# EAGLE schematic syacan (EAGLE 9.6.2)
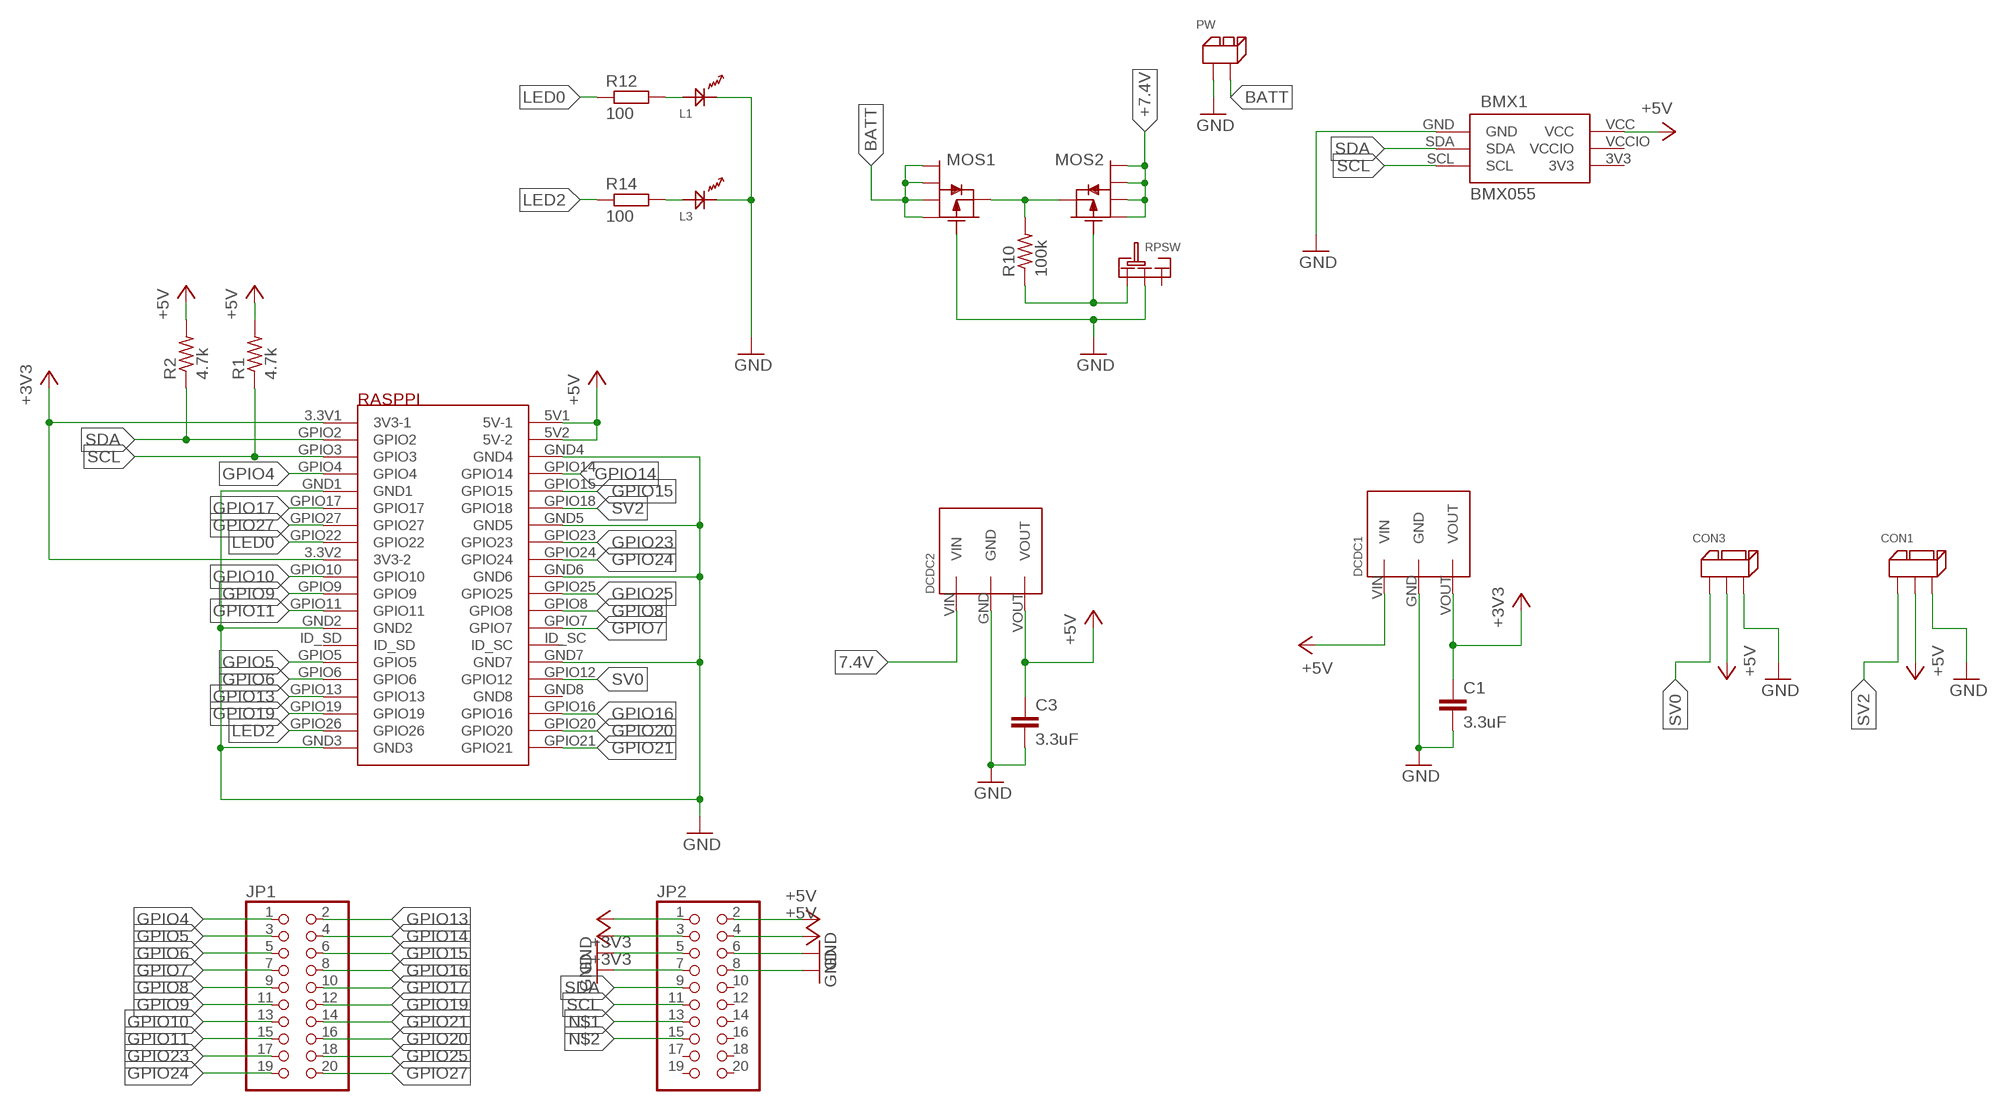
[diagram p0: schematic, sheet 1]

## Parts
BMX1  BMX055  [BMX055]
C1  3.3uF  C-EU025-024X044  [C025-024X044]
C3  3.3uF  C-EU025-024X044  [C025-024X044]
CON1  3PIN  [3PIN]
CON3  3PIN  [3PIN]
DCDC1  3.3V1A_M78AR033-1  [3.3V1A_M78AR033-1]
DCDC2  3.3V1A_M78AR033-1  [3.3V1A_M78AR033-1]
JP1  PINHD-2X10  [2X10]
JP2  PINHD-2X10  [2X10]
L1  OSXX1608C1A  [OSXX1608C1A]
L3  OSXX1608C1A  [OSXX1608C1A]
MOS1  PCH_SSM6J808R  [SSM6J808R]
MOS2  PCH_SSM6J808R  [SSM6J808R]
PW  2PIN  [2PIN]
R1  4.7k  R-US_0204/7  [0204/7]
R2  4.7k  R-US_0204/7  [0204/7]
R10  100k  R-US_R0603  [R0603]
R12  100  R-EU_R0603  [R0603]
R14  100  R-EU_R0603  [R0603]
RASPPI  RASPBERYPIZEROW  [RASPBERYPIZEROW]
RPSW  SRIDE_SWITCH  [SRIDE_SWITCH]

## Nets
7.4V: DCDC2.VIN
+3V3: C1.1 DCDC1.VOUT JP2.1 RASPPI.3.3V1(3V3-1) RASPPI.3.3V2(3V3-2)
+5V: BMX1.VCC C3.1 CON1.P$2 CON3.P$2 DCDC1.VIN DCDC2.VOUT JP2.2 R1.2 R2.2 RASPPI.5V1(5V-1) RASPPI.5V2(5V-2)
+7.4V: MOS2.1 MOS2.2 MOS2.5 MOS2.6
BATT: MOS1.1 MOS1.2 MOS1.5 MOS1.6 PW.P$2
GND: BMX1.GND C1.2 C3.2 CON1.P$3 CON3.P$3 DCDC1.GND DCDC2.GND JP2.5 JP2.6 JP2.7 JP2.8 L1.CT L3.CT MOS1.3 PW.P$1 RASPPI.GND1 RASPPI.GND2 RASPPI.GND3 RASPPI.GND4 RASPPI.GND5 RASPPI.GND6 RASPPI.GND7 RPSW.LR
GPIO4: JP1.1 RASPPI.GPIO4
GPIO5: JP1.3 RASPPI.GPIO5
GPIO6: JP1.5 RASPPI.GPIO6
GPIO7: JP1.7 RASPPI.GPIO7
GPIO8: JP1.9 RASPPI.GPIO8
GPIO9: JP1.11 RASPPI.GPIO9
GPIO10: JP1.13 RASPPI.GPIO10
GPIO11: JP1.15 RASPPI.GPIO11
GPIO13: JP1.2 RASPPI.GPIO13
GPIO14: JP1.4 RASPPI.GPIO14
GPIO15: JP1.6 RASPPI.GPIO15
GPIO16: JP1.8 RASPPI.GPIO16
GPIO17: JP1.10 RASPPI.GPIO17
GPIO19: JP1.12 RASPPI.GPIO19
GPIO20: JP1.16 RASPPI.GPIO20
GPIO21: JP1.14 RASPPI.GPIO21
GPIO23: JP1.17 RASPPI.GPIO23
GPIO24: JP1.19 RASPPI.GPIO24
GPIO25: JP1.18 RASPPI.GPIO25
GPIO27: JP1.20 RASPPI.GPIO27
LED0: R12.1 RASPPI.GPIO22
LED2: R14.1 RASPPI.GPIO26
N$1: JP2.13
N$2: JP2.15
N$3: L1.AN R12.2
N$4: JP2.3 ; supply symbol labelled +3V3
N$5: L3.AN R14.2
N$6: MOS1.4 MOS2.4 R10.2
N$7: MOS2.3 R10.1 RPSW.L
N$8: JP2.4 ; supply symbol labelled +5V
SCL: BMX1.SCL JP2.11 R1.1 RASPPI.GPIO3
SDA: BMX1.SDA JP2.9 R2.1 RASPPI.GPIO2
SV0: CON3.P$1 RASPPI.GPIO12
SV2: CON1.P$1 RASPPI.GPIO18
Unconnected: JP2.10 JP2.12 JP2.14 JP2.16 JP2.17 JP2.18 JP2.19 JP2.20 RASPPI.GND8 RASPPI.ID_SC RASPPI.ID_SD RPSW.R

## Power pins joined to a net without a drawn wire
3V3: BMX1.3V3
VCCIO: BMX1.VCCIO

## Library data of the parts
BMX1 = BMX055:BMX055
C1 C3 = rcl:C-EU: CAPACITOR, European symbol; SPICEPREFIX: C
CON1 CON3 = XR Connector:3PIN
DCDC1 DCDC2 = DC-DC:3.3V1A_M78AR033-1
JP1 JP2 = pinhead:PINHD-2X10: PIN HEADER
L1 L3 = Chip LED:OSXX1608C1A
MOS1 MOS2 = Chip MOSFET:PCH_SSM6J808R
PW = XR Connector:2PIN
R1 R2 R10 = rcl:R-US_: RESISTOR, American symbol; SPICEPREFIX: R
R12 R14 = rcl:R-EU_: RESISTOR, European symbol; SPICEPREFIX: R
RASPPI = RaspberyPiZeroW:RASPBERYPIZEROW
RPSW = Sride Switch:SRIDE_SWITCH

## Net classes
0 default: width 0.406 mm